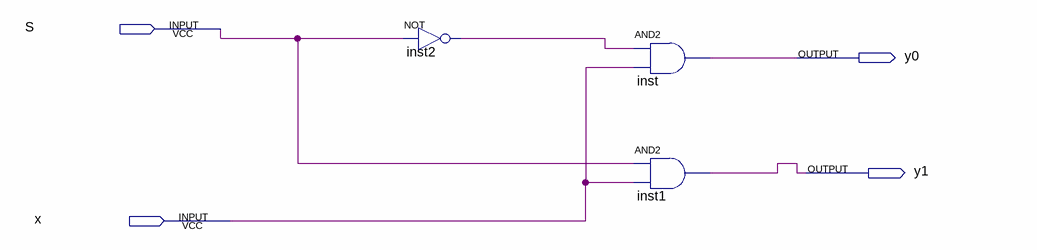
[diagram p0: schematic sheet]
// Quartus schematic dmp1-2.bdf as structural Verilog: 3 symbols, 4 pins
module \dmp1-2  (
  input  S,
  input  x,
  output y0,
  output y1
);

  wire inst2_out;

  not inst2 (inst2_out, S);
  and inst (y0, inst2_out, x);
  and inst1 (y1, S, x);
endmodule
